# Altium project PCB_TPF_G5.PrjPcb
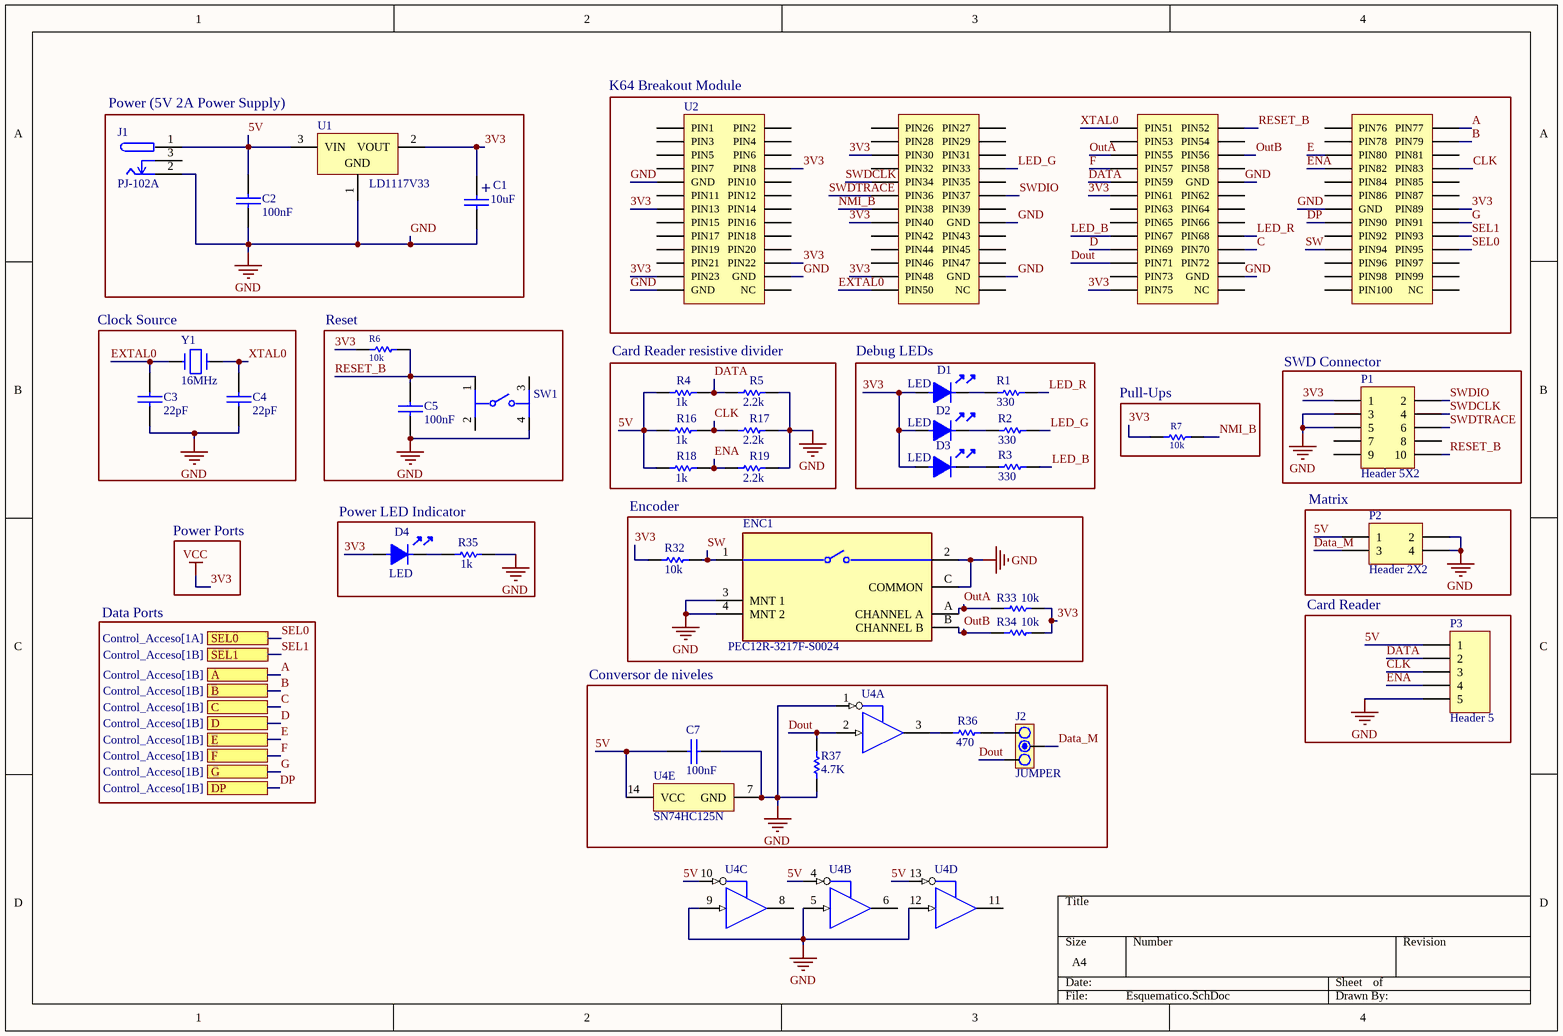
[diagram p0: Esquematico.SchDoc]
2 sheets, 76 parts. Net scope: flat (ports and power ports of the same name join across sheets).
Board file: PCB.PcbDoc
Sheets:
  Esquematico.SchDoc
  Control_Acceso.SchDoc

## Sheet Esquematico.SchDoc
size A4; SheetNumber: 1; SheetTotal: 2; SPICEModelCacheQUZINIZP: <root> / <DocumentId>QUZINIZP</DocumentId> / </root>

### Parts
C1  10uF  [CAP100RP]
C2  100nF  [CAP200]
C3  22pF  [CAP200]
C4  22pF  [CAP200]
C5  100nF  [CAP200]
C7  100nF  [CAP200]
D1  LED  [LED3]
D2  LED  [LED3]
D3  LED  [LED3]
D4  LED  [LED3]
ENC1  PEC12R-3217F-S0024  [FP-PEC12R-3217F-S0024-MFG]
J1  PJ-102A  [FP-PJ-102A-MFG]
J2  JUMPER  [JUMPER3]
P1  Header 5X2  [HDR2X5]
P2  Header 2X2  [HDR2X2]
P3  Header 5  [HDR1X5]
R1  330  [RES400]
R2  330  [RES400]
R3  330  [RES400]
R4  1k  [RES400]
R5  2.2k  [RES400]
R6  10k  [RES400]
R7  10k  [RES400]
R16  1k  [RES400]
R17  2.2k  [RES400]
R18  1k  [RES400]
R19  2.2k  [RES400]
R32  10k  [RES400]
R33  10k  [RES400]
R34  10k  [RES400]
R35  1k  [RES400]
R36  470  [RES400]
R37  4.7K  [RES400]
SW1  (no value)  [FP-B3F-1055-MFG]
U1  LD1117V33  [TO220]
U2  K64 Breakout Module  [Breakout]
U4  (no value)  [N0014A]  (parts A,B,C,D,E of 5)
Y1  16MHz  [CRISTAL PERFIL]

### Blocks framed on the sheet
Power (5V 2A Power Supply): C1 C2 J1 U1
Clock Source: C3 C4 Y1
Reset: C5 R6 SW1
Card Reader resistive divider: R4 R5 R16-R19
Debug LEDs: D1-D3 R1-R3
Pull-Ups: R7
SWD Connector: P1
Encoder: ENC1 R32-R34
Matrix: P2
Power LED Indicator: D4 R35
Card Reader: P3
Conversor de niveles: C7 J2 R36 R37 U4

### Ports
A (see Control_Acceso[1B]), B (see Control_Acceso[1B]), C (see Control_Acceso[1B]), D (see Control_Acceso[1B]), DP (see Control_Acceso[1B]), E (see Control_Acceso[1B]), F (see Control_Acceso[1B]), G (see Control_Acceso[1B]), SEL0 (see Control_Acceso[1A]), SEL1 (see Control_Acceso[1B])

### Nets
3V3: C1.1 D1.1 D2.1 D3.1 D4.1 P1.1 R6.2 R7.2 R32.1 R33.2 R34.1 U1.2(VOUT) U2.8(PIN8) U2.13(PIN13) U2.22(PIN22) U2.23(PIN23) U2.31(PIN30) U2.41(PIN40) U2.49(PIN48) U2.63(PIN61) U2.77(PIN75) U2.92(PIN89)  [also labelled VCC]
GND: C1.2 C2.2 C3.2 C4.2 C5.2 C7.2 ENC1.2 ENC1.3(MNT_1) ENC1.4(MNT_2) ENC1.C(COMMON) J1.2 P1.3 P1.5 P2.2 P2.4 P3.5 R5.2 R17.2 R19.2 R35.2 R37.1 SW1.4 U1.1(GND) U2.9(GND) U2.24(GND) U2.25(GND) U2.42(GND) U2.50(GND) U2.62(GND) U2.76(GND) U2.91(GND) U4.1(1~{OE}) U4.5(2A) U4.7(GND) U4.9(3A) U4.12(4A)
5V: C2.1 C7.1 J1.1 P2.1 P3.1 R4.1 R16.1 R18.1 U1.3(VIN) U4.4(2~{OE}) U4.10(3~{OE}) U4.13(4~{OE}) U4.14(VCC)
A: U2.80(PIN77) ; port A
B: U2.82(PIN79) ; port B
C: U2.72(PIN70) ; port C
CLK: P3.3 R16.2 R17.1 U2.86(PIN83)
D: U2.71(PIN69) ; port D
DATA: P3.2 R4.2 R5.1 U2.61(PIN59)
Data_M: J2.2 P2.3
Dout: J2.1 R37.2 U2.73(PIN71) U4.2(1A)
DP: U2.93(PIN90) ; port DP
E: U2.83(PIN80) ; port E
ENA: P3.4 R18.2 R19.1 U2.85(PIN82)
EXTAL0: C3.1 U2.51(PIN50) Y1.1
F: U2.59(PIN57) ; port F
G: U2.94(PIN91) ; port G
LED_B: R3.2 U2.69(PIN67)
LED_G: R2.2 U2.34(PIN33)
LED_R: R1.2 U2.70(PIN68)
NMI_B: R7.1 U2.39(PIN38)
OutA: ENC1.A(CHANNEL_A) R33.1 U2.57(PIN55)
OutB: ENC1.B(CHANNEL_B) R34.2 U2.58(PIN56)
RESET_B: C5.1 P1.10 R6.1 SW1.1 U2.54(PIN52)
SEL0: U2.98(PIN95) ; port SEL0
SEL1: U2.96(PIN93) ; port SEL1
SW: ENC1.1 R32.2 U2.97(PIN94)
SWDCLK: P1.4 U2.35(PIN34)
SWDIO: P1.2 U2.38(PIN37)
SWDTRACE: P1.6 U2.37(PIN36)
XTAL0: C4.1 U2.53(PIN51) Y1.2
NetD1_2: D1.2 R1.1
NetD2_2: D2.2 R2.1
NetD3_2: D3.2 R3.1
NetD4_2: D4.2 R35.1
NetJ2_3: J2.3 R36.1
NetR36_2: R36.2 U4.3(1Y)

Not connected (* = marked no-connect by the designer): J1 3; P1 7 8 9; SW1 2 3; U2 1(PIN1) 2(PIN2) 3(PIN3) 4(PIN4) 5(PIN5) 6(PIN6) 7(PIN7) 10(PIN10) 11(PIN11) 12(PIN12) 14(PIN14) 15(PIN15) 16(PIN16) 17(PIN17) 18(PIN18) 19(PIN19) 20(PIN20) 21(PIN21) 26(NC) 27(PIN26) 28(PIN27) 29(PIN28) 30(PIN29) 32(PIN31) 33(PIN32) 36(PIN35) 40(PIN39) 43(PIN42) 44(PIN43) 45(PIN44) 46(PIN45) 47(PIN46) 48(PIN47) 52(NC) 55(PIN53) 56(PIN54) 60(PIN58) 64(PIN62) 65(PIN63) 66(PIN64) 67(PIN65) 68(PIN66) 74(PIN72) 75(PIN73) 78(NC) 79(PIN76) 81(PIN78) 84(PIN81) 87(PIN84) 88(PIN85) 89(PIN86) 90(PIN87) 95(PIN92) 99(PIN96) 100(PIN97) 101(PIN98) 102(PIN99) 103(PIN100) 104(NC); U4 6(2Y) 8(3Y) 11(4Y)

### Notes on the sheet
- Power Ports
- Data Ports
- (in symbol CAPPOL) +

### Library data of the parts
C1 = CAPPOL: Electrolytic Capacitor
C2-C5 C7 = CAP: Multilayer Ceramic Capacitor
D1 D4 = LED: 3mm LED RED
D2 = LED: 3mm LED GREEN
D3 = LED: 3mm LED BLUE
ENC1 = CMP-07421-000063-1: ROTARY ENCODER; Height: 13.4mm; Width: 12.5mm; Length: 23mm; RoHS Compliant: Yes
J1 = CMP-12637-106234071-1: PJ-102A 2.0 x 6.5 mm, 2.5 A, Horizontal, Through Hole, Tapered Pins, Dc Power Jack Connector; Voltage Rating (DC): 24V; Number of Contacts: 3; Outside Diameter: 6.5mm; Gender: Male; Shielding: No; Insulation Resistance: 50MΩ; Current Rating: 2.5A; Inside Diameter: 2mm; Number of Conductors: 2; Housing Color: Black; RoHS: Compliant; Diameter: 2.1mm; Mount: Through Hole; Contact Plating: Nickel; NexarPartId: 106234071; Voltage Rating: 24V; Housing Material: Thermoplastic; Max Operating Temperature: 85°C; Color: Black; Contact Material: Copper, Nickel, Tin; Orientation: Horizontal; Packaging: Bulk; Flammability Rating: UL94 V-0; Schedule B: 8536695050, 8536695050; Contact Gender: Male; Lead Free: Lead Free; Termination: Through Hole; Min Operating Temperature: -25°C; Height: 11.2mm; Lifecycle Status: Production
J2 = JUMPER3
P1 = Header 5X2: Header, 5-Pin, Dual row; LatestRevisionDate: 17-Jul-2002; LatestRevisionNote: Re-released for DXP Platform.; Publisher: Altium Limited
P2 = Header 2X2: Header, 2-Pin, Dual row; LatestRevisionDate: 17-Jul-2002; LatestRevisionNote: Re-released for DXP Platform.; Publisher: Altium Limited
P3 = Header 5: Header, 5-Pin; LatestRevisionDate: 17-Jul-2002; LatestRevisionNote: Re-released for DXP Platform.; Publisher: Altium Limited
R1-R7 R16-R19 R32-R37 = RES: Through Hole Resistor 1/8W Carbon Film
SW1 = CMP-08834-000061-1: SWITCH TACTILE SPST-NO 0.05A 24V; Switch Travel: 0.25mm; Mechanical Life: 100000Cycles; Max Current Rating: 50mA; Actuator Color: Orange; Throw Configuration: SPST; Switch Function: Off-Mom; Contact Resistance: 100mR; Number of Poles: 1; Operating Force: 2.55N; Illumination Type: Non-Illuminated; Electrical Life: 300000Cycles; Actuator Length: 3mm; Termination: PC Pins; Contact Plating: Silver; Depth: 6mm; Max Voltage Rating (DC): 24V; Voltage Rating (DC): 24V; Package Quantity: 1500; Lead Free: Lead Free; Min Operating Temperature: -25°C; Max Operating Temperature: 70°C; Mount: Through Hole; Series: B3F; Contact Current Rating: 50mA; Orientation: Straight; Width: 6mm; RoHS Compliant: Yes; Contact Type: 1 maker; Weight: 0.25g; Packaging: Bag; Contact Material: Gold; Length: 6mm; Height: 7.3mm; Current Rating: 50mA
U1 = CMP-0244-00470-1: Fixed Low Drop Positive Voltage Regulator, 3.3V, 3-Pin TO-220; PackageVersion: ver3.0; PackageDescription: TO, Thru-Hole, Vertical, Heatsink Mounted; 3 In-Line Leads; Pitch 2.54 mm; ComponentLink1Description: Manufacturer URL; ComponentLink3URL: http://www.st.com/internet/com/TECHNICAL_RESOURCES/TECHNICAL_LITERATURE/PACKAGE_INFORMATION/CD00004649.pdf; PackageReference: TO220; ComponentLink2URL: http://www.st.com/internet/com/TECHNICAL_RESOURCES/TECHNICAL_LITERATURE/DATASHEET/CD00000544.pdf; ComponentLink3Description: Package Specification; ComponentLink2Description: Datasheet; ComponentLink1URL: http://www.st.com; DatasheetVersion: 1/11/2011
U2 = Breakout: Breakout Module Socket
U4 = CMP-0440-00135-3: Quadruple Bus Buffer Gates With 3-State Outputs, N0014A, TUBE; Generic Part Number: SN74HC125; Manufacturer: Texas Instruments; Rating: Catalog; Input Type: CMOS; Bits(#): 4; tpd @ Nom Voltage(Max)(ns): 26; VCC(Max)(V): 6; F @ Nom Voltage(Max)(Mhz): 28; VCC(Min)(V): 2; ICC @ Nom Voltage(Max)(mA): 0.16; PackageReference: N0014A; DatasheetVersion: SCLS104D; PackageVersion: http://www.ti.com/lit/ml/mpdi002c/mpdi002c.pdf; Output Type: CMOS; Operating Temperature Range(C): -40 to 85; Code_JEDEC: MS-001; Voltage(Nom)(V): 6
Y1 = CRISTAL: Cristal 16MHz

## Sheet Control_Acceso.SchDoc
size A4; SheetNumber: 2; SheetTotal: 2
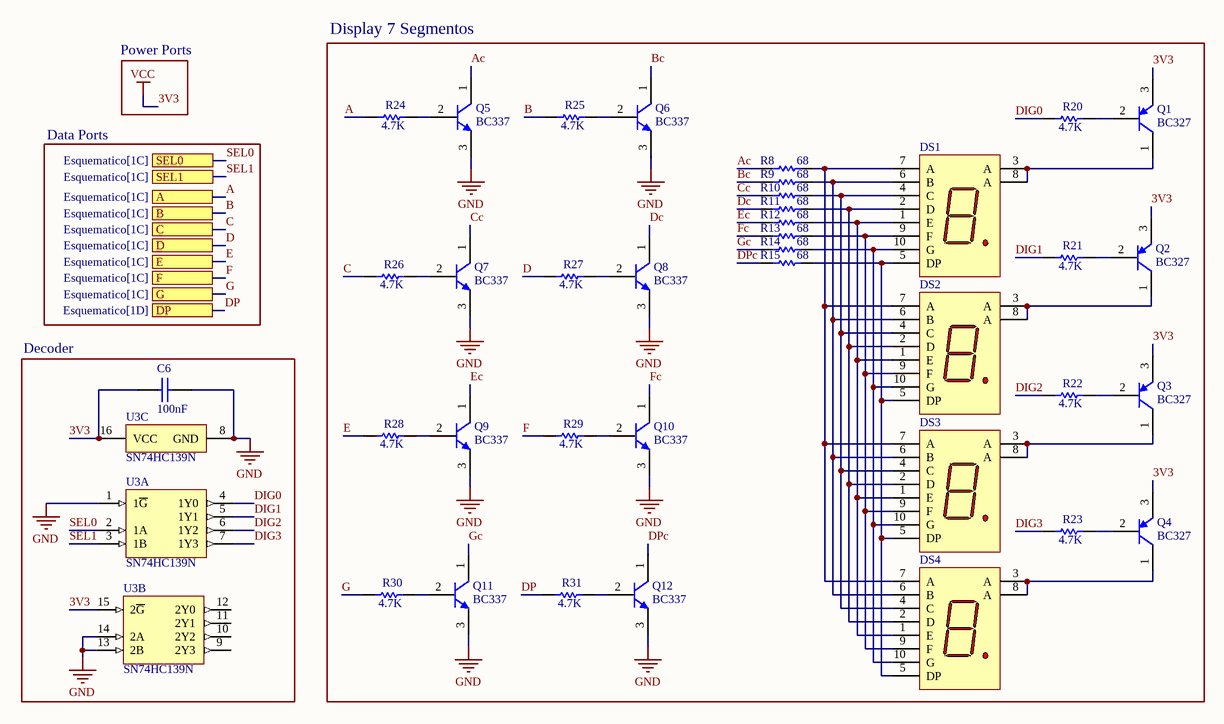
[diagram p1: Control_Acceso.SchDoc]

### Parts
C6  100nF  [CAP200]
DS1  (no value)  [WL-T7DS_L17.5W12.4H7]
DS2  (no value)  [WL-T7DS_L17.5W12.4H7]
DS3  (no value)  [WL-T7DS_L17.5W12.4H7]
DS4  (no value)  [WL-T7DS_L17.5W12.4H7]
Q1  BC327  [ONSC-TO-92-3-29-11_AM_BL]
Q2  BC327  [ONSC-TO-92-3-29-11_AM_BL]
Q3  BC327  [ONSC-TO-92-3-29-11_AM_BL]
Q4  BC327  [ONSC-TO-92-3-29-11_AM_BL]
Q5  BC337  [ONSC-TO-92-3-29-11_AM_BL]
Q6  BC337  [ONSC-TO-92-3-29-11_AM_BL]
Q7  BC337  [ONSC-TO-92-3-29-11_AM_BL]
Q8  BC337  [ONSC-TO-92-3-29-11_AM_BL]
Q9  BC337  [ONSC-TO-92-3-29-11_AM_BL]
Q10  BC337  [ONSC-TO-92-3-29-11_AM_BL]
Q11  BC337  [ONSC-TO-92-3-29-11_AM_BL]
Q12  BC337  [ONSC-TO-92-3-29-11_AM_BL]
R8  68  [RES400]
R9  68  [RES400]
R10  68  [RES400]
R11  68  [RES400]
R12  68  [RES400]
R13  68  [RES400]
R14  68  [RES400]
R15  68  [RES400]
R20  4.7K  [RES400]
R21  4.7K  [RES400]
R22  4.7K  [RES400]
R23  4.7K  [RES400]
R24  4.7K  [RES400]
R25  4.7K  [RES400]
R26  4.7K  [RES400]
R27  4.7K  [RES400]
R28  4.7K  [RES400]
R29  4.7K  [RES400]
R30  4.7K  [RES400]
R31  4.7K  [RES400]
U3  SN74HC139N  [N0016A]  (parts A,B,C of 3)

### Blocks framed on the sheet
Display 7 Segmentos: DS1-DS4 Q1-Q12 R8-R15 R20-R31
Decoder: C6 U3

### Ports
A (see Esquematico[1C]), B (see Esquematico[1C]), C (see Esquematico[1C]), D (see Esquematico[1C]), DP (see Esquematico[1D]), E (see Esquematico[1C]), F (see Esquematico[1C]), G (see Esquematico[1C]), SEL0 (see Esquematico[1C]), SEL1 (see Esquematico[1C])

### Nets
3V3: C6.1 Q1.3(E) Q2.3(E) Q3.3(E) Q4.3(E) U3.15(2~{G}) U3.16(VCC)  [also labelled VCC]
GND: C6.2 Q5.3(E) Q6.3(E) Q7.3(E) Q8.3(E) Q9.3(E) Q10.3(E) Q11.3(E) Q12.3(E) U3.1(1~{G}) U3.8(GND) U3.13(2B) U3.14(2A)
A: R24.1 ; port A
Ac: Q5.1(C) R8.1
B: R25.1 ; port B
Bc: Q6.1(C) R9.1
C: R26.1 ; port C
Cc: Q7.1(C) R10.1
D: R27.1 ; port D
Dc: Q8.1(C) R11.1
DIG0: R20.1 U3.4(1Y0)
DIG1: R21.1 U3.5(1Y1)
DIG2: R22.1 U3.6(1Y2)
DIG3: R23.1 U3.7(1Y3)
DP: R31.1 ; port DP
DPc: Q12.1(C) R15.1
E: R28.1 ; port E
Ec: Q9.1(C) R12.1
F: R29.1 ; port F
Fc: Q10.1(C) R13.1
G: R30.1 ; port G
Gc: Q11.1(C) R14.1
SEL0: U3.2(1A) ; port SEL0
SEL1: U3.3(1B) ; port SEL1
NetDS1_1: DS1.1(E) DS2.1(E) DS3.1(E) DS4.1(E) R12.2
NetDS1_2: DS1.2(D) DS2.2(D) DS3.2(D) DS4.2(D) R11.2
NetDS1_3: DS1.3(A) DS1.8(A) Q1.1(C)
NetDS1_4: DS1.4(C) DS2.4(C) DS3.4(C) DS4.4(C) R10.2
NetDS1_5: DS1.5(DP) DS2.5(DP) DS3.5(DP) DS4.5(DP) R15.2
NetDS1_6: DS1.6(B) DS2.6(B) DS3.6(B) DS4.6(B) R9.2
NetDS1_7: DS1.7(A) DS2.7(A) DS3.7(A) DS4.7(A) R8.2
NetDS1_9: DS1.9(F) DS2.9(F) DS3.9(F) DS4.9(F) R13.2
NetDS1_10: DS1.10(G) DS2.10(G) DS3.10(G) DS4.10(G) R14.2
NetDS2_3: DS2.3(A) DS2.8(A) Q2.1(C)
NetDS3_3: DS3.3(A) DS3.8(A) Q3.1(C)
NetDS4_3: DS4.3(A) DS4.8(A) Q4.1(C)
NetQ1_2: Q1.2(B) R20.2
NetQ2_2: Q2.2(B) R21.2
NetQ3_2: Q3.2(B) R22.2
NetQ4_2: Q4.2(B) R23.2
NetQ5_2: Q5.2(B) R24.2
NetQ6_2: Q6.2(B) R25.2
NetQ7_2: Q7.2(B) R26.2
NetQ8_2: Q8.2(B) R27.2
NetQ9_2: Q9.2(B) R28.2
NetQ10_2: Q10.2(B) R29.2
NetQ11_2: Q11.2(B) R30.2
NetQ12_2: Q12.2(B) R31.2

Not connected (* = marked no-connect by the designer): U3 9(2Y3) 10(2Y2) 11(2Y1) 12(2Y0)

### Notes on the sheet
- Power Ports
- Data Ports

### Library data of the parts
C6 = CAP: Multilayer Ceramic Capacitor
DS1-DS4 = CMP-03913-119893999-3: 7-Seg Display, Comm Anode, Super Red Rohs Compliant: Yes; Forward Voltage: 2V; Dominant Wavelength: 635nm; Max Reverse Voltage (DC): 5V; Forward Current: 100mA; Luminous Intensity: 20mcd; Width: 12.4mm; Max Operating Temperature: 85°C; Min Operating Temperature: -40°C; Height: 7mm; RoHS: Compliant; Length: 17.5mm
Q1-Q4 = CMP-1048-01577-1: Amplifier Transistor, PNP Silicon, 3-Pin TO-92, Pb-Free, Ammo Box; Manufacturer: On Semiconductor; PartNumber: BC327-25ZL1G; IC Continuous (A): -0.8; ComponentLink2URL: http://www.onsemi.com/pub_link/Collateral/BC327-D.PDF; ComponentLink1Description: Manufacturer URL; PackageReference: TO-92-3-29-11_AM_BL; Polarity: PNP; ComponentLink1URL: http://www.onsemi.com/; ComponentLink3Description: Package Specification; PackageDescription: 3-Pin Transistor Outline, Body 4.825 x 3.685 mm, Pitch 1.27 mm; PackageVersion: Rev. AM; ComponentLink3URL: http://www.onsemi.com/pub_link/Collateral/MAC97-D.PDF; ComponentLink2Description: Datasheet; RoHS: TRUE; DatasheetVersion: Rev. 6; Mounting Technology: Through Hole; Packing: Ammo Box
Q5-Q12 = CMP-1048-01583-1: Amplifier Transistor, NPN Silicon, 3-Pin TO-92, Pb-Free, Ammo Box; PartNumber: BC337-40ZL1G; Manufacturer: On Semiconductor; IC Continuous (A): 0.8; ComponentLink2URL: http://www.onsemi.com/pub_link/Collateral/BC337-D.PDF; PackageReference: TO-92-3-29-11_AM_BL; ComponentLink1Description: Manufacturer URL; RoHS: TRUE; PackageVersion: Rev. AM; ComponentLink3URL: http://www.onsemi.com/pub_link/Collateral/MAC97-D.PDF; ComponentLink3Description: Package Specification; Packing: Ammo Box; DatasheetVersion: Rev. 8; Polarity: NPN; ComponentLink1URL: http://www.onsemi.com/; ComponentLink2Description: Datasheet; PackageDescription: 3-Pin Transistor Outline, Body 4.825 x 3.685 mm, Pitch 1.27 mm; Mounting Technology: Through Hole
R8-R15 R20-R31 = RES: Through Hole Resistor 1/8W Carbon Film
U3 = CMP-1633-00660-2: Dual 2-Line To 4-Line Decoders/Demultiplexers, N0016A, TUBE; Manufacturer: Texas Instruments; Technology Family: HC; VCC(Min)(V): 2; Voltage(Nom)(V): 3.3,5; F @ Nom Voltage(Max)(Mhz): 28; Output Type: CMOS; Bits(#): 4; VCC(Max)(V): 6; ICC @ Nom Voltage(Max)(mA): 0.08; Function: Decoder/Demultiplexer; Input Type: LVTTL/CMOS; Output Drive (IOL/IOH)(Max)(mA): 5.2/-5.2; Schmitt Trigger: No; Rating: Catalog; Configuration: 2：4; tpd @ Nom Voltage(Max)(ns): 44; Code_JEDEC: MS-001; DatasheetVersion: SCLS108D; Generic Part Number: SN74HC139; Operating Temperature Range(C): -40 to 85; PackageReference: N0016A; Channels(#): 2; Type: Standard

## Nets that join several sheets
3V3: Esquematico (22 pins), Control_Acceso (7 pins)
GND: Esquematico (36 pins), Control_Acceso (13 pins)
A: Esquematico (U2.80), Control_Acceso (R24.1)
B: Esquematico (U2.82), Control_Acceso (R25.1)
C: Esquematico (U2.72), Control_Acceso (R26.1)
D: Esquematico (U2.71), Control_Acceso (R27.1)
DP: Esquematico (U2.93), Control_Acceso (R31.1)
E: Esquematico (U2.83), Control_Acceso (R28.1)
F: Esquematico (U2.59), Control_Acceso (R29.1)
G: Esquematico (U2.94), Control_Acceso (R30.1)
SEL0: Esquematico (U2.98), Control_Acceso (U3.2)
SEL1: Esquematico (U2.96), Control_Acceso (U3.3)